# Altium schematic sheet QTR.SchDoc
size A4
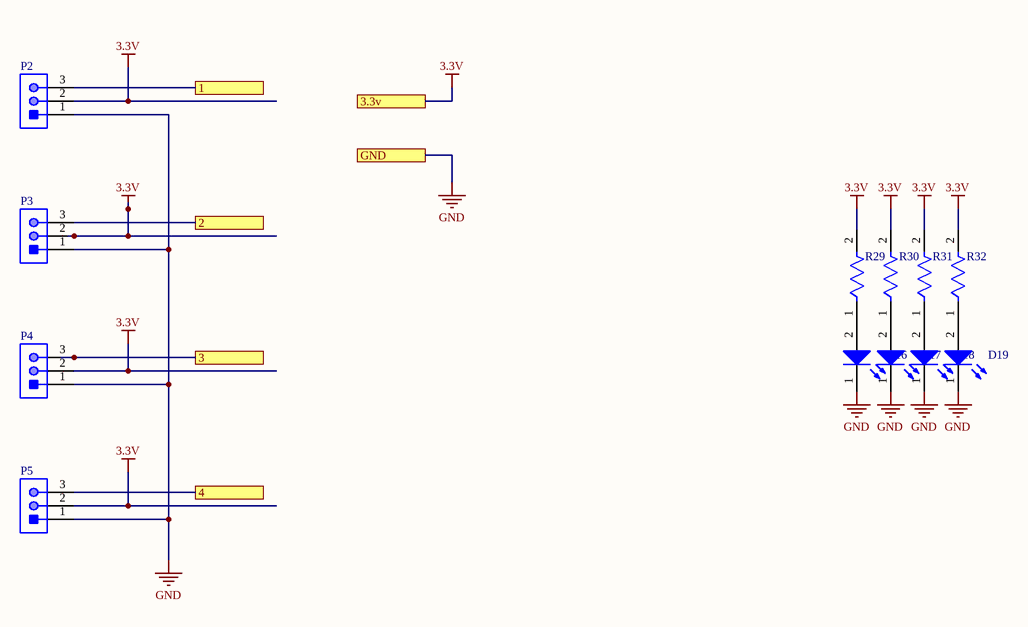
[diagram p0: QTR.SchDoc]

## Parts
D16  150080BS75000  [WL-SMCW_0805_150080xx75000]  (value not drawn)
D17  150080BS75000  [WL-SMCW_0805_150080xx75000]  (value not drawn)
D18  150080BS75000  [WL-SMCW_0805_150080xx75000]  (value not drawn)
D19  150080BS75000  [WL-SMCW_0805_150080xx75000]  (value not drawn)
P2  B3B-PH-K-S(LF)(SN)  [JST-B3B-PH-K-S-3_V]  (value not drawn)
P3  B3B-PH-K-S(LF)(SN)  [JST-B3B-PH-K-S-3_V]  (value not drawn)
P4  B3B-PH-K-S(LF)(SN)  [JST-B3B-PH-K-S-3_V]  (value not drawn)
P5  B3B-PH-K-S(LF)(SN)  [JST-B3B-PH-K-S-3_V]  (value not drawn)
R29  ERJ-6ENF1500V  [FP-ERJ6EN-IPC_A]  (value not drawn)
R30  ERJ-6ENF1500V  [FP-ERJ6EN-IPC_A]  (value not drawn)
R31  ERJ-6ENF1500V  [FP-ERJ6EN-IPC_A]  (value not drawn)
R32  ERJ-6ENF1500V  [FP-ERJ6EN-IPC_A]  (value not drawn)

## Ports
1, 2, 3, 3.3v, 4, GND

## Nets
3.3V: P2.2 P3.2 P4.2 P5.2 R29.2 R30.2 R31.2 R32.2 ; port 3.3v
GND: D16.1(K) D17.1(K) D18.1(K) D19.1(K) P2.1 P3.1 P4.1 P5.1 ; port GND
1: P2.3 ; port 1
2: P3.3 ; port 2
3: P4.3 ; port 3
4: P5.3 ; port 4
NetD16_2: D16.2(A) R29.1
NetD17_2: D17.2(A) R30.1
NetD18_2: D18.2(A) R31.1
NetD19_2: D19.2(A) R32.1

## Library data of the parts
D16-D19 = CMP-1426-00008-6: NexarPartId: 29717779; Test Current: 20mA; Lens Style: Clear, Rectangular; Forward Current: 100mA; Power Dissipation: 105mW; Dominant Wavelength: 470nm; Reverse Voltage: 5V; Viewing Angle: 140°; Luminous Intensity: 145mcd; Color: Blue; Forward Voltage: 3.2V; Max Junction Temperature (Tj): 95°C; Peak Wavelength: 465nm; Min Operating Temperature: -40°C; Mount: Surface Mount; Case Code (Imperial): 0805; Packaging: Tape and Reel; Lead Free: Lead Free; Length: 2mm; Case/Package: 0805; Case Code (Metric): 2012; Max Operating Temperature: 85°C; Height: 700µm; RoHS: Compliant; Max Reverse Voltage (DC): 5V; REACH SVHC: Unknown; Width: 1.25mm; Wavelength: 470nm
P2-P5 = CMP-2000-05164-1: Male Header, Pitch 2 mm, 1 x 3 Position, Height 6 mm, Tail Length 3.4 mm, -25 to 85 degC, RoHS, Bulk; Manufacturer: JST; Style/Orientation: StraightHeader/Plug; Pitch: 2mm; No of Positions: 3; Termination: Crimp; Manufacturer URL: http://www.jst.com/home2.html; Datasheet Version: Oct-06; Type: ShroudedHeader; Datasheet URL: https://datasheet.ciiva.com/11746/0900766b80826550-11746939.pdf
R29-R32 = CMP-2001-04437-2: NexarPartId: 55422415; Power Rating: 125mW; Temperature Coefficient: 100ppm/°C; Tolerance: 1%; Working Voltage: 150V; Resistance: 150Ω; Max Power Dissipation: 125mW; Composition: Thick Film; Case Code (Metric): 2012; Depth: 1.25mm; Radiation Hardening: No; Height: 600µm; Lead Free: Lead Free; Case/Package: 0805; REACH SVHC: No SVHC; RoHS: Compliant; Number of Pins: 2; Min Operating Temperature: -55°C; Packaging: Cut Tape (CT); Max Operating Temperature: 155°C; Lifecycle Status: Production; Military Standard: Not; Contact Plating: Tin; Mount: Surface Mount; Voltage Rating: 150V; Schedule B: 8533210045, 8533210045; Width: 1.2446mm; Features: Automotive AEC-Q200; Length: 2mm; Termination: SMD/SMT; Case Code (Imperial): 0805; Number of Terminations: 2; Voltage Rating (DC): 150V